# Altium schematic sheet Top_layer.SchDoc
size A
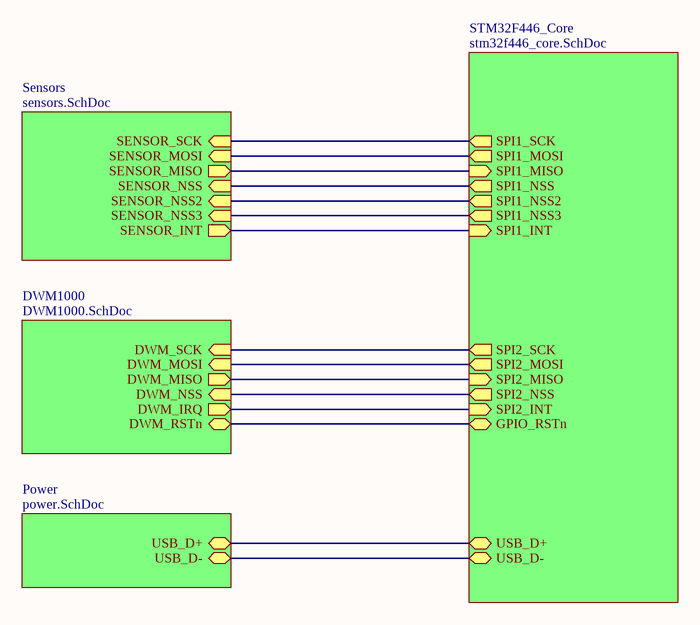
[diagram p0: Top_layer.SchDoc]

## Sub-sheets
DWM1000 = DWM1000.SchDoc: DWM_NSS (in), DWM_IRQ (out), DWM_MISO (out), DWM_SCK (in), DWM_MOSI (in), DWM_RSTn (bidir)
Power = power.SchDoc: USB_D+ (bidir), USB_D- (bidir)
Sensors = sensors.SchDoc: SENSOR_SCK (in), SENSOR_MOSI (in), SENSOR_MISO (out), SENSOR_NSS (in), SENSOR_NSS2 (in), SENSOR_NSS3 (in), SENSOR_INT (out)
STM32F446_Core = stm32f446_core.SchDoc: USB_D+ (bidir), USB_D- (bidir), SPI1_SCK (out), SPI1_MOSI (out), SPI1_MISO (in), SPI1_NSS (out), SPI1_NSS2 (out), SPI1_NSS3 (out), SPI1_INT (in), SPI2_SCK (out), SPI2_MOSI (out), SPI2_MISO (in), SPI2_NSS (out), SPI2_INT (in), GPIO_RSTn (bidir)

## Nets
(unnamed): sheet STM32F446_Core/USB_D+, sheet Power/USB_D+
(unnamed): sheet STM32F446_Core/USB_D-, sheet Power/USB_D-
(unnamed): sheet STM32F446_Core/SPI1_SCK, sheet Sensors/SENSOR_SCK
(unnamed): sheet STM32F446_Core/SPI1_MOSI, sheet Sensors/SENSOR_MOSI
(unnamed): sheet STM32F446_Core/SPI1_MISO, sheet Sensors/SENSOR_MISO
(unnamed): sheet STM32F446_Core/SPI1_NSS, sheet Sensors/SENSOR_NSS
(unnamed): sheet STM32F446_Core/SPI1_NSS2, sheet Sensors/SENSOR_NSS2
(unnamed): sheet STM32F446_Core/SPI1_NSS3, sheet Sensors/SENSOR_NSS3
(unnamed): sheet STM32F446_Core/SPI1_INT, sheet Sensors/SENSOR_INT
(unnamed): sheet STM32F446_Core/SPI2_SCK, sheet DWM1000/DWM_SCK
(unnamed): sheet STM32F446_Core/SPI2_MOSI, sheet DWM1000/DWM_MOSI
(unnamed): sheet STM32F446_Core/SPI2_MISO, sheet DWM1000/DWM_MISO
(unnamed): sheet STM32F446_Core/SPI2_NSS, sheet DWM1000/DWM_NSS
(unnamed): sheet STM32F446_Core/SPI2_INT, sheet DWM1000/DWM_IRQ
(unnamed): sheet STM32F446_Core/GPIO_RSTn, sheet DWM1000/DWM_RSTn